# EAGLE design shield (EAGLE 9.3.1)
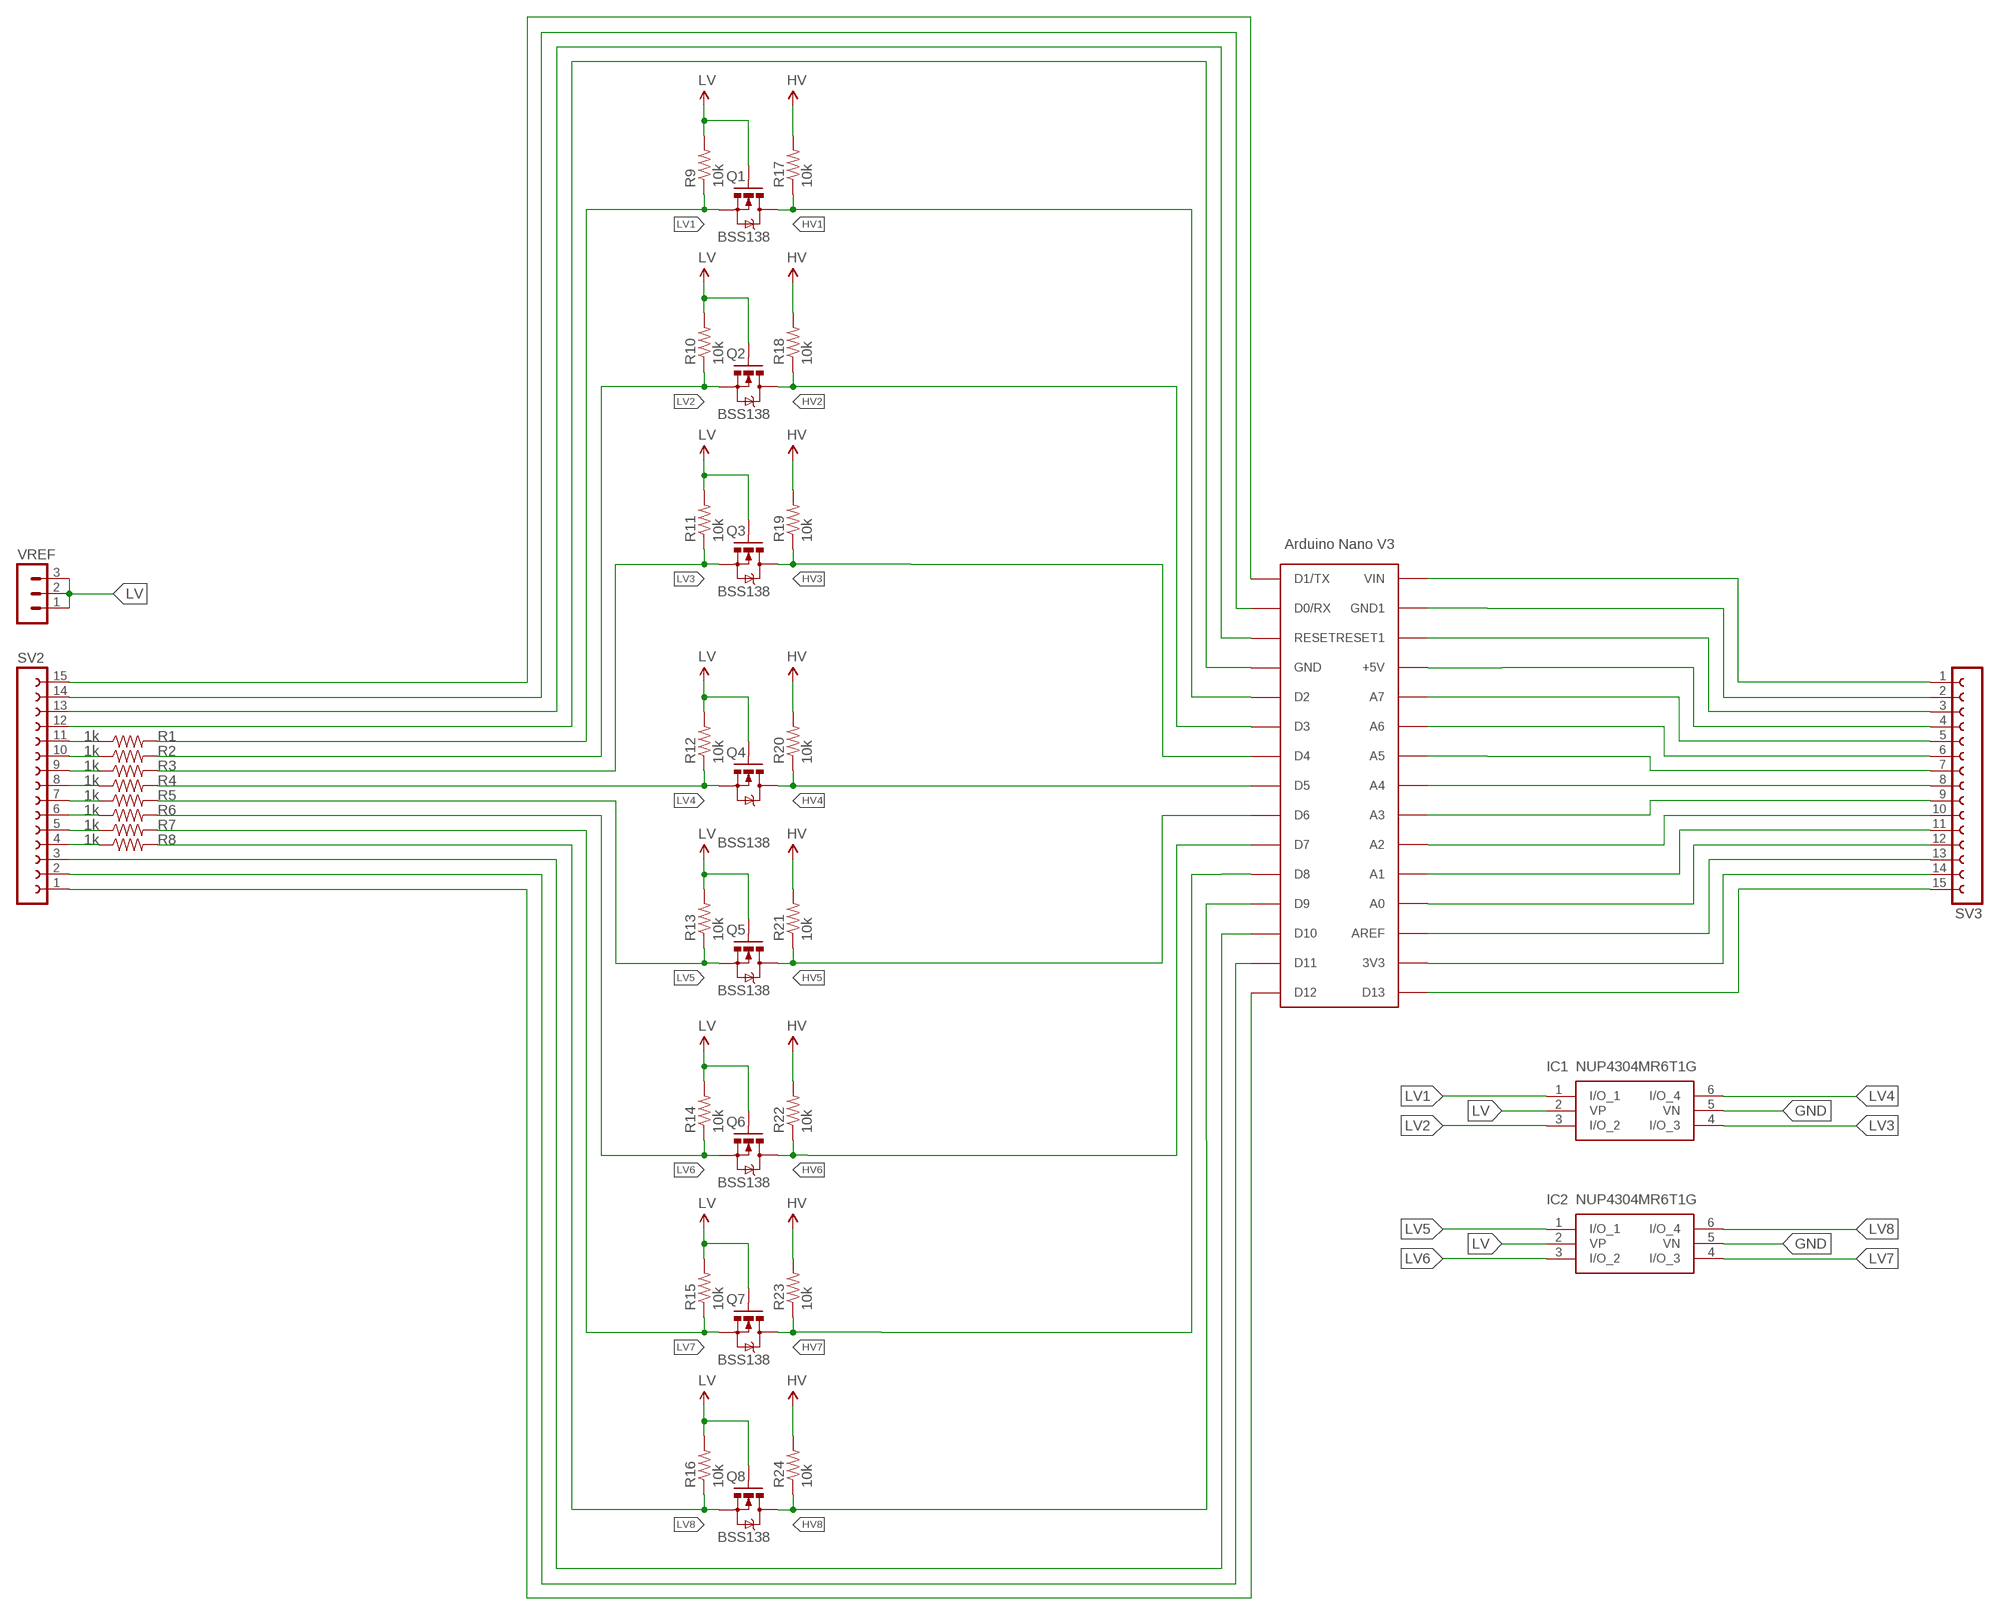
[diagram p0: schematic, sheet 1]

## Parts
IC1  NUP4304MR6T1G  [SOT95P275X110-6N]
IC2  NUP4304MR6T1G  [SOT95P275X110-6N]
Q1  BSS138  MOSFET-NCHANNELSMD  [SOT23-3]
Q2  BSS138  MOSFET-NCHANNELSMD  [SOT23-3]
Q3  BSS138  MOSFET-NCHANNELSMD  [SOT23-3]
Q4  BSS138  MOSFET-NCHANNELSMD  [SOT23-3]
Q5  BSS138  MOSFET-NCHANNELSMD  [SOT23-3]
Q6  BSS138  MOSFET-NCHANNELSMD  [SOT23-3]
Q7  BSS138  MOSFET-NCHANNELSMD  [SOT23-3]
Q8  BSS138  MOSFET-NCHANNELSMD  [SOT23-3]
R1  1k  R-US_R0402  [R0402]
R2  1k  R-US_R0402  [R0402]
R3  1k  R-US_R0402  [R0402]
R4  1k  R-US_R0402  [R0402]
R5  1k  R-US_R0402  [R0402]
R6  1k  R-US_R0402  [R0402]
R7  1k  R-US_R0402  [R0402]
R8  1k  R-US_R0402  [R0402]
R9  10k  R-US_R0402  [R0402]
R10  10k  R-US_R0402  [R0402]
R11  10k  R-US_R0402  [R0402]
R12  10k  R-US_R0402  [R0402]
R13  10k  R-US_R0402  [R0402]
R14  10k  R-US_R0402  [R0402]
R15  10k  R-US_R0402  [R0402]
R16  10k  R-US_R0402  [R0402]
R17  10k  R-US_R0402  [R0402]
R18  10k  R-US_R0402  [R0402]
R19  10k  R-US_R0402  [R0402]
R20  10k  R-US_R0402  [R0402]
R21  10k  R-US_R0402  [R0402]
R22  10k  R-US_R0402  [R0402]
R23  10k  R-US_R0402  [R0402]
R24  10k  R-US_R0402  [R0402]
SV2  FE15-1  [FE15]
SV3  FE15-1  [FE15]
U1  CRE-LIB1-NL_ARDUINONANO40-MIL-HOLES  [ARDUINO-NANO-32-40MIL-HOLES]
VREF  MA03-1  [MA03-1]

## Nets
_LV1: R1.1 SV2.11
_LV2: R2.1 SV2.10
_LV3: R3.1 SV2.9
_LV4: R4.1 SV2.8
_LV5: R5.1 SV2.7
_LV6: R6.1 SV2.6
_LV7: R7.1 SV2.5
_LV8: R8.1 SV2.4
GND: IC1.5(VN) IC2.5(VN) SV2.12 SV3.2 U1.GND U1.GND1
HV: R17.2 R18.2 R19.2 R20.2 R21.2 R22.2 R23.2 R24.2 SV3.4 U1.+5V
HV1: Q1.3(D) R17.1 U1.D2
HV2: Q2.3(D) R18.1 U1.D3
HV3: Q3.3(D) R19.1 U1.D4
HV4: Q4.3(D) R20.1 U1.D5
HV5: Q5.3(D) R21.1 U1.D6
HV6: Q6.3(D) R22.1 U1.D7
HV7: Q7.3(D) R23.1 U1.D8
HV8: Q8.3(D) R24.1 U1.D9
LV: IC1.2(VP) IC2.2(VP) Q1.1(G) Q2.1(G) Q3.1(G) Q4.1(G) Q5.1(G) Q6.1(G) Q7.1(G) Q8.1(G) R9.2 R10.2 R11.2 R12.2 R13.2 R14.2 R15.2 R16.2 VREF.1 VREF.2 VREF.3
LV1: IC1.1(I/O_1) Q1.2(S) R1.2 R9.1
LV2: IC1.3(I/O_2) Q2.2(S) R2.2 R10.1
LV3: IC1.4(I/O_3) Q3.2(S) R3.2 R11.1
LV4: IC1.6(I/O_4) Q4.2(S) R4.2 R12.1
LV5: IC2.1(I/O_1) Q5.2(S) R5.2 R13.1
LV6: IC2.3(I/O_2) Q6.2(S) R6.2 R14.1
LV7: IC2.4(I/O_3) Q7.2(S) R7.2 R15.1
LV8: IC2.6(I/O_4) Q8.2(S) R8.2 R16.1
N$2: SV3.9 U1.A4(A3)
N$3: SV3.10 U1.A5(A2)
N$4: SV3.11 U1.A6(A1)
N$5: SV3.12 U1.A7(A0)
N$6: SV3.13 U1.AREF
N$7: SV3.14 U1.3V3
N$8: SV3.15 U1.D13
N$9: SV3.8 U1.A3(A4)
N$11: SV3.6 U1.A1(A6)
N$12: SV3.5 U1.A0(A7)
N$14: SV3.3 U1.RESET1
N$15: SV3.7 U1.A2(A5)
N$17: SV2.15 U1.D1/TX
N$18: SV2.14 U1.D0/RX
N$19: SV2.13 U1.RESET
N$29: SV2.3 U1.D10
N$30: SV2.2 U1.D11
N$31: SV2.1 U1.D12
VIN: SV3.1 U1.VIN

## Library data of the parts
IC1 IC2 = NUP4304MR6T1G:NUP4304MR6T1G: Quad Uni-Directional TVS Diode Array, 6-pin TSOP Source: Datasheet <http://www.onsemi.com/pub/Collateral/NUP4304M6-D.PDF>; ALLIED_NUMBER: 70467563; ALLIED_PRICE-STOCK: http://www.alliedelec.com/on-semiconductor-nup4304mr6t1g/70467563/; DESCRIPTION: Quad Uni-Directional TVS Diode Array, 6-pin TSOP; HEIGHT: 1.1mm; MANUFACTURER_NAME: ON Semiconductor; MANUFACTURER_PART_NUMBER: NUP4304MR6T1G; MOUSER_PART_NUMBER: 863-NUP4304MR6T1G; MOUSER_PRICE-STOCK: https://www.mouser.com/Search/Refine.aspx?Keyword=863-NUP4304MR6T1G; RS_PART_NUMBER: 8024310
Q1-Q8 = SparkFun:MOSFET-NCHANNEL
R1-R24 = resistor:R-US_: RESISTOR, American symbol
SV2 SV3 = con-lsta-bigger:FE15-1: FEMALE HEADER; OC_FARNELL: unknown; OC_NEWARK: unknown
U1 = CRE-Lib1-nl:CRE-LIB1-NL_ARDUINONANO: Arduino Nano
VREF = con-lstb-edit:MA03-1: PIN HEADER; OC_FARNELL: unknown; OC_NEWARK: unknown

## Board
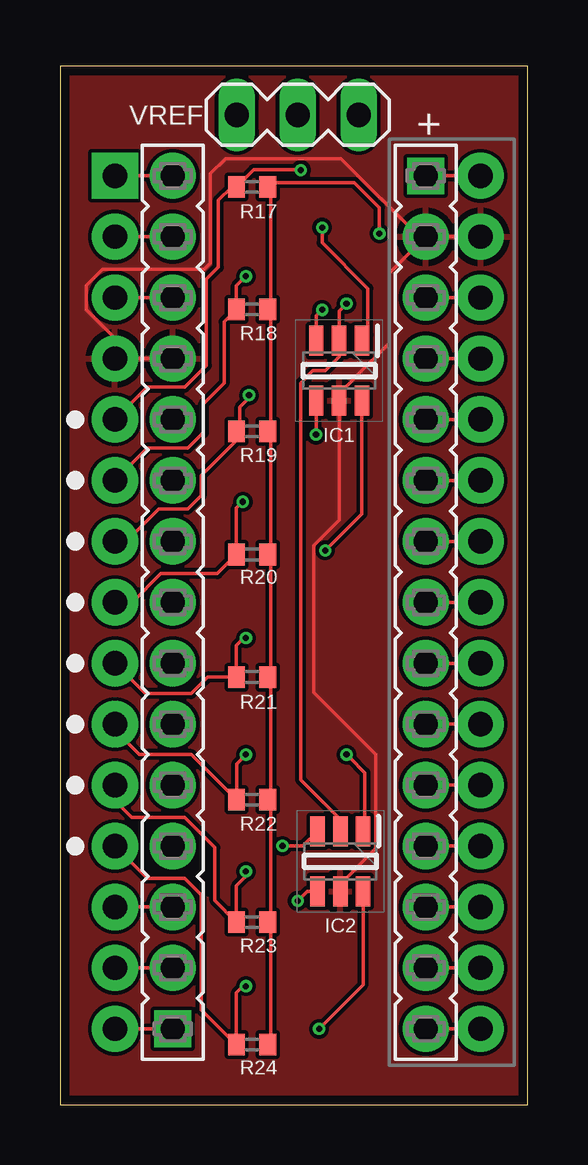
[diagram p1: board, top side]
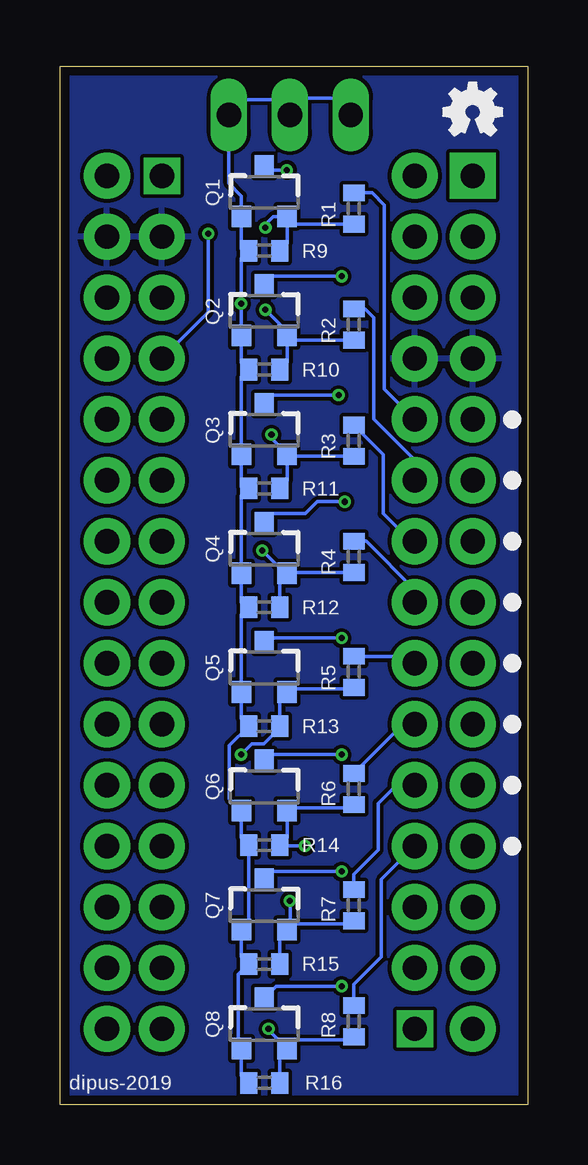
[diagram p2: board, bottom side, seen from below]

Size 19.48 x 43.3 mm. Coordinates in mm from the lower left corner, seen from the top.
Outline: 0,0 19.48,0 19.48,43.3 0,43.3 0,0
Copper layers (1*16): Top 0.035559375mm / dielectric 1.6mm / Bottom 0.035559375mm
Design rules "oshpark-2layer": minimum track width 6mil, minimum drill 10mil, track to track 6mil, track to pad 6mil, pad to pad 6mil, via to via 6mil, smd to smd 6mil, copper to edge 15mil, drill to drill 6mil, minimum pad ring 5mil, minimum via ring 5mil, stop-mask expansion 2.5mil, vias tented up to drill 0mil, thermal gap 10mil

### Footprints (pad centres in the part's own frame; a part is rotated, then mirrored left to right if it is on the bottom)
SOT95P275X110-6N = smd 1.25 x 0.6: 1 -1.25,0.95; 2 -1.25,0; 3 -1.25,-0.95; 4 1.25,-0.95; 5 1.25,0; 6 1.25,0.95
SOT23-3 = smd 0.8 x 0.9: 1 -0.95,-1; 2 0.95,-1; 3 0,1.1
R0402 = smd 0.7 x 0.9: 1 -0.65,0; 2 0.65,0
FE15 = drill 1.016 square: 1 -17.78,0 | drill 1.016 pad 1.93: 2 -15.24,0; 3 -12.7,0; 4 -10.16,0; 5 -7.62,0; 6 -5.08,0; 7 -2.54,0; 8 0,0; 9 2.54,0; 10 5.08,0; 11 7.62,0; 12 10.16,0; 13 12.7,0; 14 15.24,0; 15 17.78,0
ARDUINO-NANO-32-40MIL-HOLES = drill 1.016 pad 1.93: 3V3 15.24,-35.56; +5V 15.24,-10.16; A0 15.24,-12.7; A1 15.24,-15.24; A2 15.24,-17.78; A3 15.24,-20.32; A4 15.24,-22.86; A5 15.24,-25.4; A6 15.24,-27.94; A7 15.24,-30.48; AREF 15.24,-33.02; D0/RX 0,-5.08; D2 0,-12.7; D3 0,-15.24; D4 0,-17.78; D5 0,-20.32; D6 0,-22.86; D7 0,-25.4; D8 0,-27.94; D9 0,-30.48; D10 0,-33.02; D11 0,-35.56; D12 0,-38.1; D13 15.24,-38.1; GND 0,-10.16; GND1 15.24,-5.08; RESET 0,-7.62; RESET1 15.24,-7.62; VIN 15.24,-2.54 | drill 1.016 pad 1.93 square: D1/TX 0,-2.54
MA03-1 = drill 1.016 long: 1 -2.54,0; 2 0,0; 3 2.54,0

### Placement (x,y rotation side)
IC1  11.63,30.61 270 top
IC2  11.68,10.16 270 top
Q1  10.97,38.04 0 bottom
Q2  10.97,33.08 0 bottom
Q3  10.97,28.13 0 bottom
Q4  10.97,23.17 0 bottom
Q5  10.97,18.22 0 bottom
Q6  10.97,13.26 0 bottom
Q7  10.97,8.31 0 bottom
Q8  10.97,3.35 0 bottom
R1  7.24,37.37 270 bottom
R2  7.24,32.53 270 bottom
R3  7.24,27.69 270 bottom
R4  7.24,22.85 270 bottom
R5  7.24,18.06 270 bottom
R6  7.24,13.17 270 bottom
R7  7.24,8.33 270 bottom
R8  7.24,3.49 270 bottom
R9  10.97,35.61 180 bottom
R10  10.97,30.65 180 bottom
R11  10.97,25.7 180 bottom
R12  10.97,20.74 180 bottom
R13  10.97,15.79 180 bottom
R14  10.97,10.83 180 bottom
R15  10.97,5.88 180 bottom
R16  10.97,0.92 180 bottom
R17  8,38.27 0 top
R18  8,33.16 0 top
R19  8,28.08 0 top
R20  8,22.95 0 top
R21  8,17.84 0 top
R22  8,12.73 0 top
R23  8,7.62 0 top
R24  8,2.51 0 top
SV2  4.7,20.95 90 top
SV3  15.24,20.95 270 top
U1  2.29,41.27 0 top
U$1  [OSHW-LOGO-MINI]  2.29,41.4 0 bottom
VREF  9.91,41.27 0 top

### Tracks (layer width: path | path; a pad name or v marks a point on that pad's centre or on a via)
_LV1
  Bottom 0.152: R1.1 6.48,38.02 5.97,37.51 5.97,29.84 SV2.11
_LV2
  Bottom 0.152: R2.1 6.77,33.18 6.4,32.82 6.4,28.59 4.7,26.89 SV2.10
_LV3
  Bottom 0.152: R3.1 6.02,27.12 6.02,24.65 4.86,23.5 SV2.9
_LV4
  Bottom 0.152: R4.1 6.73,23.5 4.7,21.47 SV2.8
_LV5
  Bottom 0.152: R5.1 4.99,18.71 SV2.7
_LV6
  Bottom 0.152: R6.1 5.18,15.87 SV2.6
_LV7
  Bottom 0.152: R7.1 7.24,9.62 6.22,10.63 6.22,12.57 5.46,13.33 SV2.5
_LV8
  Bottom 0.152: R8.1 7.24,5.03 6.1,6.17 6.1,9.4 SV2.4
GND
  Top 0.152: SV3.2 U1.GND1 | SV2.12 U1.GND 2.29,31.97 1.09,33.16 1.09,34.15 1.79,34.85 6.02,34.85 6.26,35.09 6.26,38.81 6.91,39.46 11.7,39.46 14.96,36.2 SV3.2 | SV3.2 13.72,34.67 13.72,31.75 13.11,31.14 12.97,31 11.63,29.66 IC1.5 11.63,24.38 10.57,23.31 10.57,17.2 13.16,14.61 13.16,10.69 11.63,9.16 11.63,8.96 IC2.5
  pour Bottom: -1.4,44.58 21.08,44.58 21.08,-3.68 -1.4,-3.68
  pour Top: -2.79,45.59 22.1,45.59 22.1,-1.91 -2.79,-1.91
HV  (via drill 0.25)
  Top 0.152: SV3.4 U1.+5V | R24.2 8.78,2.64 8.78,7.49 R23.2 8.78,7.75 8.78,12.6 R22.2 8.78,12.86 8.78,17.71 R21.2 8.78,17.96 8.78,22.82 R20.2 8.78,23.07 8.78,27.95 R19.2 8.78,28.21 8.78,33.04 R18.2 8.78,33.29 8.78,38.14 R17.2 8.84,38.46 12.27,38.46 13.31,37.41 v13.31,36.32
  Bottom 0.152: v13.31,36.32 13.31,33.05 SV3.4
HV1  (via drill 0.25)
  Top 0.152: v10.03,38.97 10.02,38.99 8.07,38.99 7.46,38.38 R17.1 7.15,38.27 6.6,37.72 6.6,34.93 6.1,34.42 6.1,30.82 5.19,29.92 3.63,29.92 U1.D2
  Bottom 0.152: v10.03,38.97 10.81,38.97 Q1.3
HV2  (via drill 0.25)
  Top 0.152: U1.D3 3.63,27.38 5.32,27.38 5.97,28.03 5.97,29.21 6.84,30.08 6.84,32.65 R18.1 7.35,34.15 v7.75,34.54
  Bottom 0.152: v7.75,34.54 10.61,34.54 Q2.3
HV3  (via drill 0.25)
  Top 0.152: U1.D4 2.77,23.5 4.11,24.84 5.32,24.84 5.89,25.41 5.89,26.24 7.35,27.7 R19.1 7.49,28.22 7.49,29.08 7.87,29.46 v7.87,29.59
  Bottom 0.152: Q3.3 10.61,29.59 v7.87,29.59
HV4  (via drill 0.25)
  Top 0.152: U1.D5 3.01,20.95 4.21,22.15 6.55,22.15 R20.1 7.35,24.88 v7.62,25.15
  Bottom 0.152: Q4.3 10.59,24.65 9.26,24.65 8.76,25.15 v7.62,25.15
HV5  (via drill 0.25)
  Top 0.152: U1.D6 3.56,17.15 5.46,17.15 6.15,17.84 R21.1 7.35,19.16 7.62,19.43 7.71,19.43 v7.75,19.46
  Bottom 0.152: v7.75,19.46 10.82,19.46 Q5.3
HV6  (via drill 0.25)
  Top 0.152: U1.D7 2.29,15.62 3.3,14.6 5.48,14.6 R22.1 7.37,14.22 v7.75,14.6
  Bottom 0.152: v7.75,14.6 10.73,14.6 Q6.3
HV7  (via drill 0.25)
  Top 0.152: U1.D8 2.29,12.69 2.98,11.99 5.19,11.99 6.45,10.73 6.45,8.52 R23.1 7.35,9.13 7.75,9.53 v7.75,9.74
  Bottom 0.152: v7.75,9.74 10.64,9.74 Q7.3
HV8  (via drill 0.25)
  Top 0.152: U1.D9 3.63,9.45 5.19,9.45 5.89,8.75 5.89,3.97 R24.1 7.35,4.68 7.62,4.95 v7.75,4.95
  Bottom 0.152: Q8.3 10.47,4.95 v7.75,4.95
LV  (via drill 0.25)
  Top 0.152: IC2.2 11.63,11.46 11.63,11.95 10.02,13.55 10.02,30.09 10.54,30.61 11.05,30.61 11.63,31.19 IC1.2 11.63,33.09 v11.94,33.4
  Bottom 0.152: R16.2 11.92,1.22 Q8.1 12.05,2.48 12.05,5.45 R15.2 11.92,6.18 Q7.1 11.62,7.61 R14.2 11.92,11.13 Q6.1 12.43,12.77 12.43,14.98 R13.2 11.92,16.09 Q5.1 11.92,20.44 11.67,20.69 | 11.67,20.69 R12.2 | 11.67,20.69 11.92,20.94 Q4.1 11.92,25.4 11.74,25.58 | 11.74,25.58 R11.2 | 11.74,25.58 11.92,25.76 Q3.1 11.92,30.35 R10.2 11.92,30.95 Q2.1 11.92,33.38 | 11.92,33.38 11.92,35.31 11.74,35.49 | 11.74,35.49 R9.2 | 11.74,35.49 11.92,35.67 Q1.1 11.92,37.89 12.45,38.42 VREF.3 11.81,41.91 10.67,41.91 10.03,41.27 VREF.2 9.21,41.97 8.06,41.97 VREF.1 | v11.94,33.4 11.92,33.38
LV1  (via drill 0.25)
  Top 0.152: IC1.1 12.83,32.11 12.83,34.04 10.92,35.94 v10.92,36.58
  Bottom 0.152: R1.2 9.71,36.72 Q1.2 | Q1.2 10.02,35.91 R9.1 | Q1.2 10.59,37.04 10.92,36.7 v10.92,36.58
LV2  (via drill 0.25)
  Top 0.152: v10.92,33.15 10.68,32.9 IC1.3
  Bottom 0.152: R2.2 9.82,31.88 Q2.2 10.02,32 | 10.02,32 10.02,30.95 R10.1 | v10.92,33.15 10.02,32.25 10.02,32
LV3  (via drill 0.25)
  Top 0.152: v10.67,27.94 10.68,27.95 IC1.4
  Bottom 0.152: R3.2 9.93,27.04 Q3.2 | Q3.2 10.02,26 R11.1 | Q3.2 10.67,27.77 v10.67,27.94
LV4  (via drill 0.25)
  Top 0.152: v11.05,23.11 12.58,24.64 IC1.6
  Bottom 0.152: 9.91,22.2 R4.2 | 9.91,22.2 9.99,22.2 Q4.2 10.32,21.87 R12.1 | v11.05,23.11 10.14,22.2 9.91,22.2
LV5  (via drill 0.25)
  Top 0.152: IC2.1 12.7,11.48 12.7,13.84 12.07,14.48 v11.94,14.6
  Bottom 0.152: R5.2 7.3,17.34 9.89,17.34 Q5.2 10.32,16.92 R13.1 10.32,15.71 10.99,15.05 11.49,15.05 v11.94,14.6
LV6  (via drill 0.25)
  Top 0.152: IC2.3 10.11,10.79 v9.27,10.79
  Bottom 0.152: R6.2 7.37,12.39 9.89,12.39 Q6.2 10.02,11.13 R14.1 10.28,10.79 v9.27,10.79
LV7  (via drill 0.25)
  Top 0.152: v9.91,8.51 10.31,8.91 IC2.4
  Bottom 0.152: R7.2 7.37,7.55 9.77,7.55 Q7.2 | Q7.2 10.32,7.01 R15.1 | v9.91,8.51 9.89,8.5 9.89,7.43 Q7.2
LV8  (via drill 0.25)
  Top 0.152: v10.79,3.17 12.63,5.01 IC2.6
  Bottom 0.152: R8.2 7.37,2.71 9.66,2.71 Q8.2 | Q8.2 10.32,2.05 R16.1 | Q8.2 10.79,3.13 v10.79,3.17
N$2
  Top 0.152: SV3.9 U1.A4
N$3
  Top 0.152: SV3.10 U1.A5
N$4
  Top 0.152: SV3.11 U1.A6
N$5
  Top 0.152: SV3.12 U1.A7
N$6
  Top 0.152: SV3.13 U1.AREF
N$7
  Top 0.152: SV3.14 U1.3V3
N$8
  Top 0.152: SV3.15 U1.D13
N$9
  Top 0.152: SV3.8 U1.A3
N$11
  Top 0.152: SV3.6 U1.A1
N$12
  Top 0.152: SV3.5 U1.A0
N$14
  Top 0.152: SV3.3 U1.RESET1
N$15
  Top 0.152: SV3.7 U1.A2
N$17
  Top 0.152: U1.D1/TX SV2.15
N$18
  Top 0.152: U1.D0/RX SV2.14
N$19
  Top 0.152: U1.RESET SV2.13
N$29
  Top 0.152: U1.D10 SV2.3
N$30
  Top 0.152: U1.D11 SV2.2
N$31
  Top 0.152: U1.D12 SV2.1
VIN
  Top 0.152: SV3.1 U1.VIN

### Text on the board
tNames: +
bNames: dipus-2019